# EAGLE design esp_tiny1 (EAGLE 7.6.0)
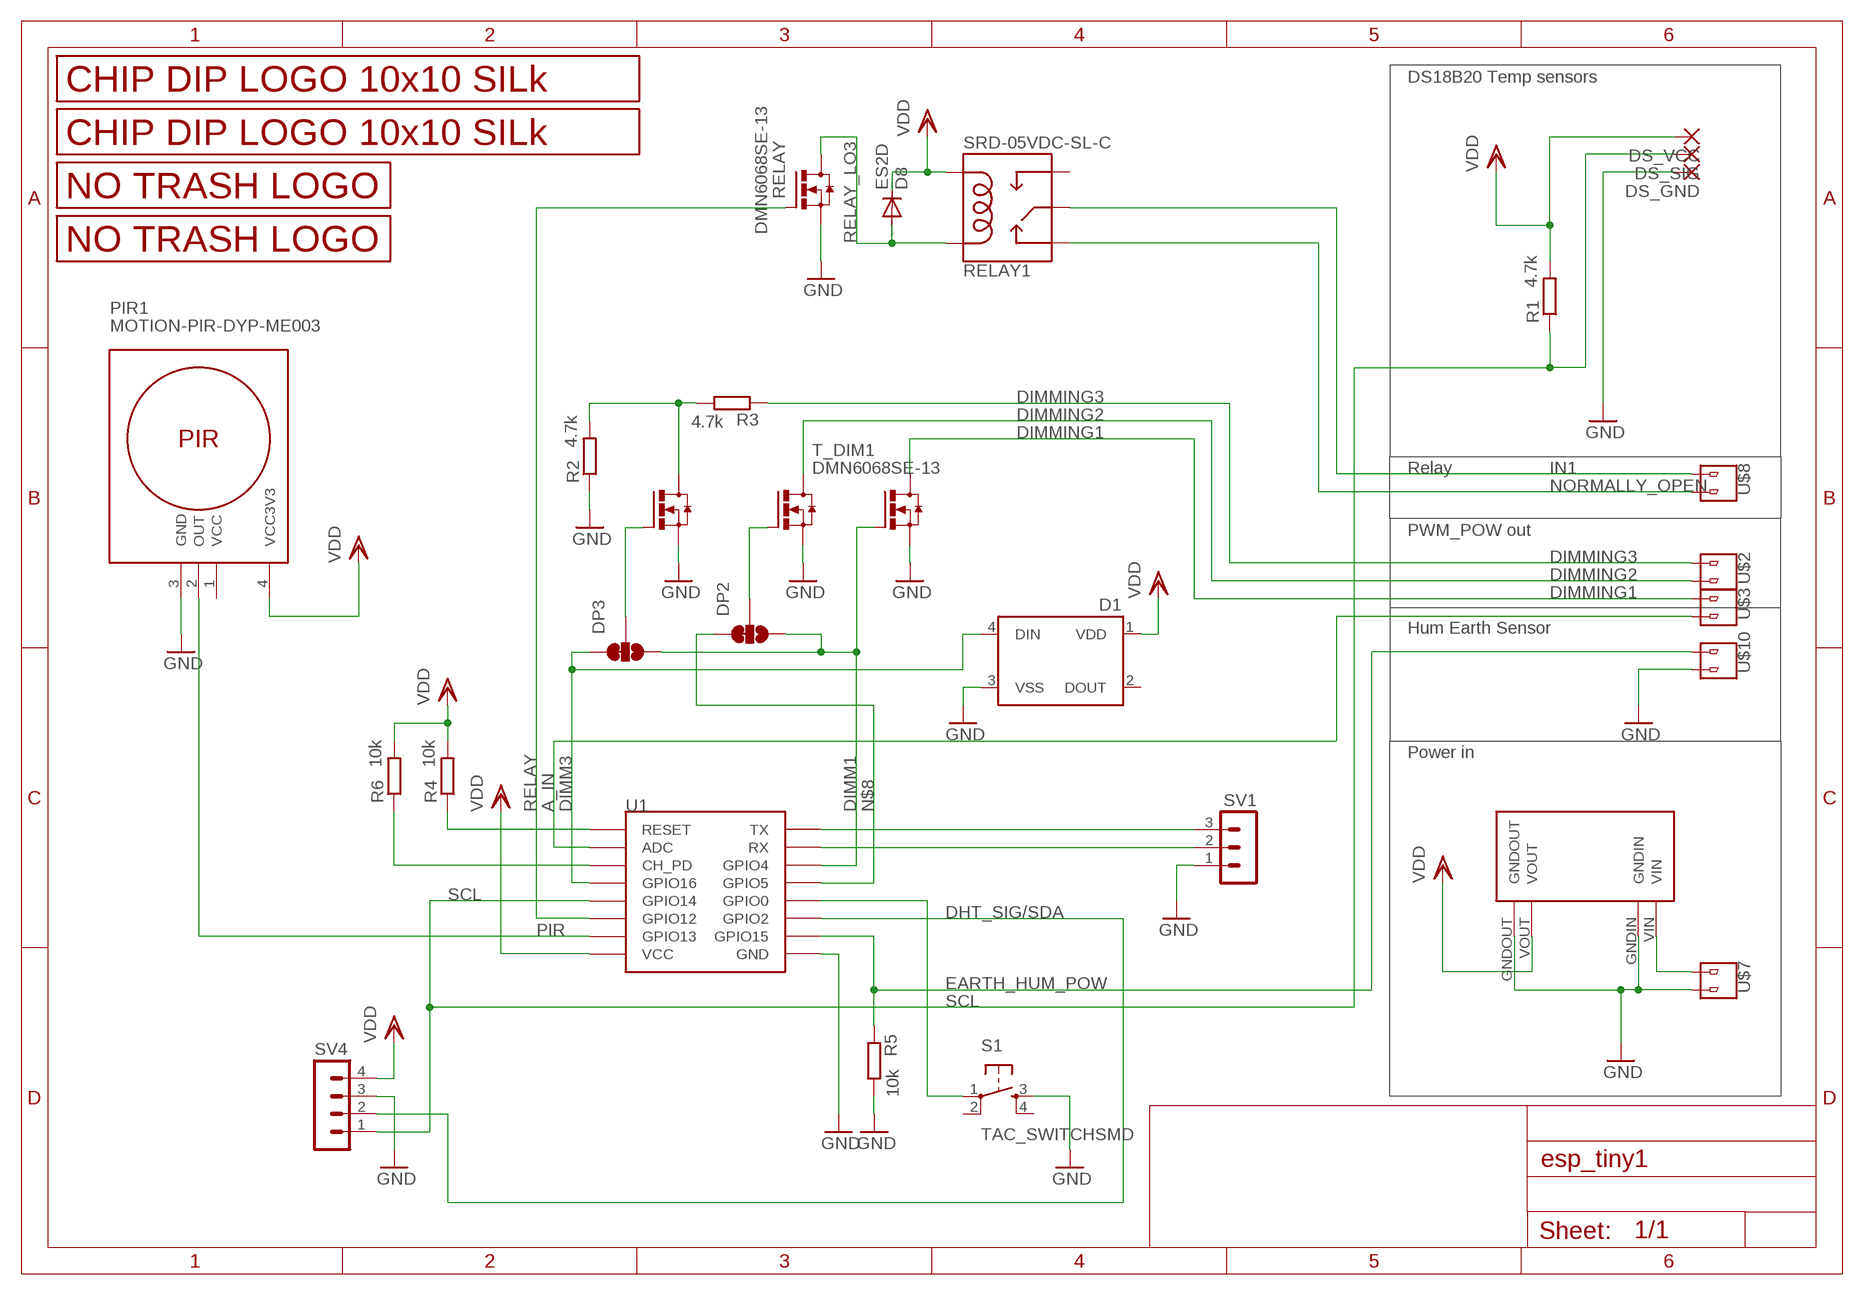
[diagram p0: schematic, sheet 1]

## Parts
D1  WS2812B  [WS2812B]
D8  ES2D  DIODE-SMB  [SMB]
DP2  SMD_SJ_3WAY_CLOSED  [SMD_SJ_3WAY_CLOSED]
DP3  SMD_SJ_3WAY_CLOSED  [SMD_SJ_3WAY_CLOSED]
DS_GND  SMD2  [SMD1,27-2,54]
DS_SIG  SMD2  [SMD1,27-2,54]
DS_VCC  SMD2  [SMD1,27-2,54]
PIR1  MOTION-PIR-DYP-ME003  [MOTION-PIR-DYP-ME003_FRAMELESS]
R1  4.7k  R-EU_M0805  [M0805]
R2  4.7k  R-EU_M0805  [M0805]
R3  4.7k  R-EU_M0805  [M0805]
R4  10k  R-EU_M0805  [M0805]
R5  10k  R-EU_M0805  [M0805]
R6  10k  R-EU_M0805  [M0805]
RELAY  DMN6068SE-13  NMOSFET_SMD_223  [SOT223]
RELAY1  SRD-05VDC-SL-C  RELAYPTH  [SRD-05VDC-SL-C]
S1  TAC_SWITCHSMD  [TACTILE-SWITCH-SMD]
SV1  MA03-1  [MA03-1]
SV4  MA04-1  [MA04-1]
T_DIM1  DMN6068SE-13  NMOSFET_SMD_223  [SOT223]
T_DIM2  DMN6068SE-13  NMOSFET_SMD_223  [SOT223]
T_DIM3  DMN6068SE-13  NMOSFET_SMD_223  [SOT223]
U1  ESP12SMD  [ESP12-SMD]
U$1  LOGO_10X10_SILK  [LOGO2_10X10_SILK]
U$2  V1  2_PIN_CONNECTOR  [2_SCREW_PIN]
U$3  V1  2_PIN_CONNECTOR  [2_SCREW_PIN]
U$4  LOGO_NO_TRASHNO_TRASH  [LOGO_ROHS_NO_TRASH]
U$7  V1  2_PIN_CONNECTOR  [2_SCREW_PIN]
U$8  V1  2_PIN_CONNECTOR  [2_SCREW_PIN]
U$9  LOGO_NO_TRASHROHS  [LOGO_ROHS_SYM]
U$10  V1  2_PIN_CONNECTOR  [2_SCREW_PIN]
U$11  LOGO_10X10_SILK  [LOGO2_10X10_SILK]
U$12  MP1584EN  [MP1584EN]

## Nets
A_IN: U1.ADC U$3.P$2
DHT_SIG/SDA: SV4.2 U1.GPIO2
DIMM1: DP2.3 DP3.3 T_DIM1.1(G) U1.GPIO4
DIMM3: D1.4(DIN) DP3.1 U1.GPIO16
DIMMING1: T_DIM1.2(D) T_DIM1.4(D) U$3.P$1
DIMMING2: T_DIM2.2(D) T_DIM2.4(D) U$2.P$2
DIMMING3: R3.1 U$2.P$1
EARTH_HUM_POW: R5.1 U1.GPIO15 U$10.P$1
GND: D1.3(VSS) DS_GND.1(P) PIR1.3(GND) R2.1 R5.2 RELAY.3(S) S1.3 SV1.1 SV4.3 T_DIM1.3(S) T_DIM2.3(S) T_DIM3.3(S) U1.GND U$7.P$2 U$10.P$2 U$12.GNDIN U$12.GNDOUT
IN1: RELAY1.SWCOMMON U$8.P$1
N$1: R6.1 U1.CH_PD
N$2: R4.1 U1.RESET
N$3: R2.2 R3.2 T_DIM3.2(D) T_DIM3.4(D)
N$4: SV1.3 U1.TXD0(TX)
N$6: SV1.2 U1.RXD0(RX)
N$7: S1.1 U1.GPIO0
N$8: DP2.1 U1.GPIO5
N$17: U$7.P$1 U$12.VIN
N$20: DP3.2 T_DIM3.1(G)
N$21: DP2.2 T_DIM2.1(G)
NORMALLY_OPEN: RELAY1.SWCLOSED(SWCLOSE) U$8.P$2
PIR: PIR1.2(OUT) U1.GPIO13
RELAY: RELAY.1(G) U1.GPIO12
RELAY_LO3: D8.A RELAY1.COIL1 RELAY.2(D) RELAY.4(D)
SCL: DS_SIG.1(P) R1.1 SV4.1 U1.GPIO14
VDD: D1.1(VDD) D8.C DS_VCC.1(P) PIR1.4(VCC3V3) R1.2 R4.2 R6.2 RELAY1.COIL0 SV4.4 U1.VCC U$12.VOUT
Unconnected: D1.2(DOUT) RELAY1.SWOPEN S1.2 S1.4

## Notes on the sheet
- DS18B20 Temp sensors
- Relay
- PWM_POW out
- Hum Earth Sensor
- Power in

## Power pins joined to a net without a drawn wire
VCC: PIR1.1(VCC)

## Library data of the parts
D1 = SparkFun-LED:WS2812B: WS2812B - Intelligent control LED integrated light source Technical Specifications: Power Supply Voltage (VDD): 3.5 to 5.3 V Input Voltage (VI): -0.5 to VDD+0.5 V Operating Junction Temperature (Topt): -25°C to +80°C Storage Temperature Range (Tstg): -55°C to +150°C; PROD_ID: DIO-12503
D8 = diode:DIODE-: DIODE
DP2 DP3 = JKW_CHIP:SMD_SJ_3WAY_CLOSED
DS_GND DS_SIG DS_VCC = wirepad:SMD2: SMD PAD
PIR1 = diy-modules:MOTION-PIR-DYP-ME003: PIR Motion Sensor Module DYP-ME003 based on BISS0001 pyroelectic detector Click here to find device on ebay.com <http://www.ebay.com/sch/dyp+me003>
R1-R6 = rcl:R-EU_: RESISTOR, European symbol
RELAY T_DIM1-T_DIM3 = transistor-power:NMOSFET_SMD_223
RELAY1 = JKW_CHIP:RELAY: SPDT relay (COM-00101)
S1 = SparkFun-Retired:TAC_SWITCH: Momentary Switch Button commonly used for reset or general input. Spark Fun Electronics SKU : COM-00097 SMT- SWCH-08247; PROD_ID: SWCH-08247
SV1 = con-lstb:MA03-1: PIN HEADER; OC_FARNELL: unknown; OC_NEWARK: unknown
SV4 = con-lstb:MA04-1: PIN HEADER; OC_FARNELL: unknown; OC_NEWARK: unknown
U1 = esp8266modules:ESP12: ESP8266 Wifi module 12
U$1 U$11 = JKW_CHIP:LOGO_10X10_SILK
U$2 U$3 U$7 U$8 U$10 = JKW_CHIP:2_PIN_CONNECTOR
U$4 U$9 = JKW_CHIP:LOGO_NO_TRASH
U$12 = JKW_CHIP:MP1584EN

## Board
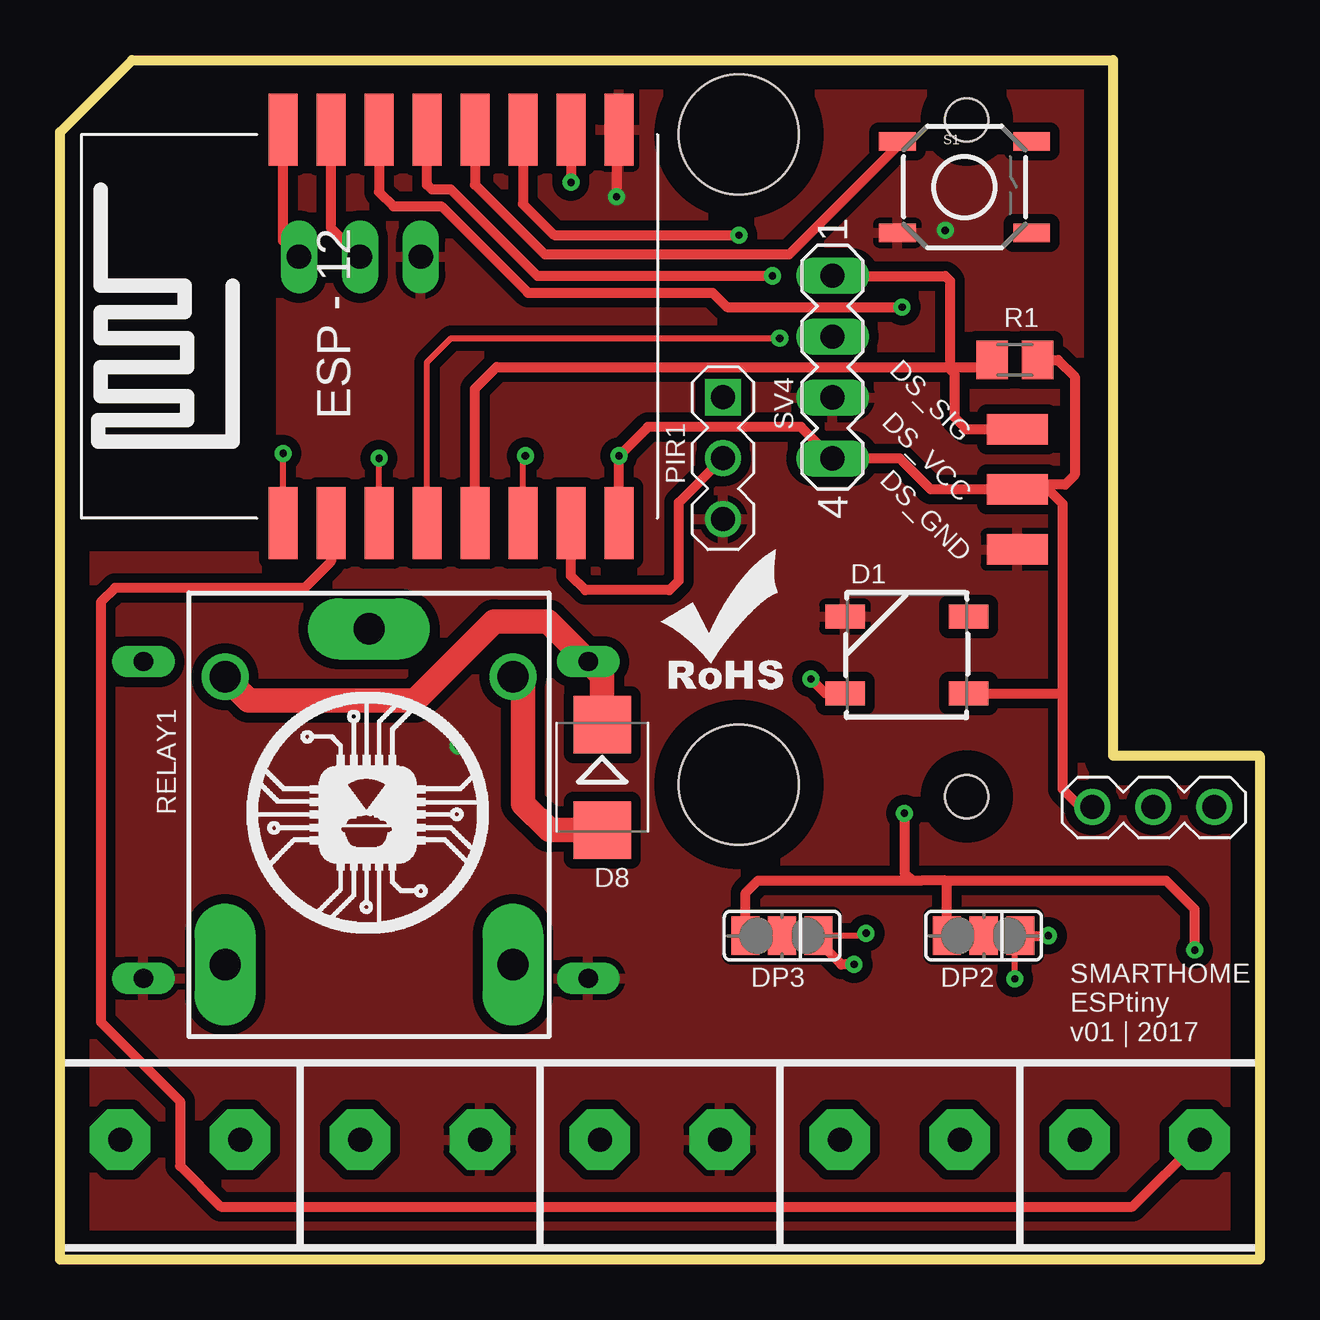
[diagram p1: board, top side]
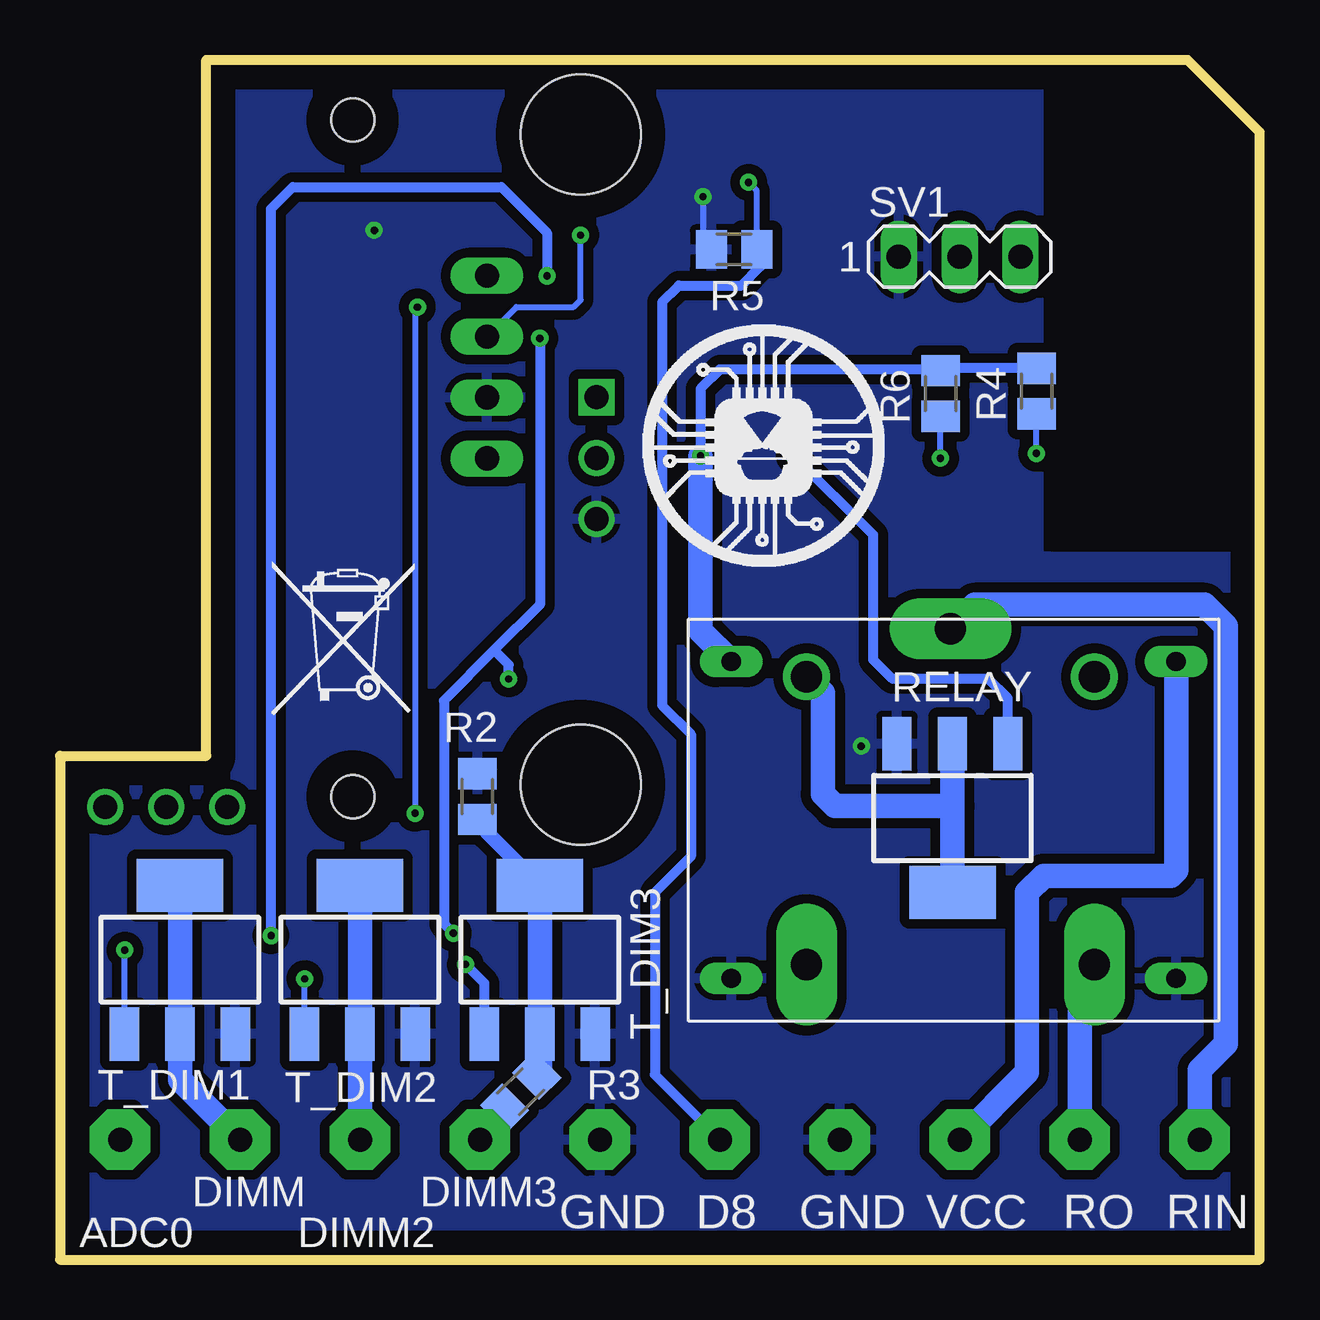
[diagram p2: board, bottom side, seen from below]

Size 50 x 50 mm. Coordinates in mm from the lower left corner, seen from the top.
Outline: 0,0 0,47 3,50 43.9,50 43.9,21 50,21 50,0 0,0
Copper layers (1*16): Top 0.035mm / dielectric 1.5mm / Bottom 0.035mm
Design rules "default": minimum track width 10mil, minimum drill 24mil, track to track 8mil, track to pad 8mil, pad to pad 8mil, via to via 8mil, smd to smd 8mil, copper to edge 40mil, drill to drill 8mil, minimum pad ring 10mil, minimum via ring 8mil, stop-mask expansion 4mil, vias tented up to drill 0mil, thermal gap 10mil
Holes 5 mm at 28.3,19.8 28.3,46.9
tRestrict: area 0.6,30 to 8.5,47.4
bRestrict: area 0.6,29.9 to 8.6,47.3

### Footprints (pad centres in the part's own frame; a part is rotated, then mirrored left to right if it is on the bottom)
WS2812B = smd 1.651 x 1: 1 -2.577,1.6; 2 -2.577,-1.6; 3 2.577,-1.6; 4 2.577,1.6
SMB = smd 2.4 x 2.4: A 2.2,0; C -2.2,0
SMD_SJ_3WAY_CLOSED = smd 1.168 x 1.6: 1 -1.524,0; 2 0,0; 3 1.524,0
SMD1,27-2,54 = smd 1.27 x 2.54: 1 0,0
MOTION-PIR-DYP-ME003_FRAMELESS = drill 1 square: 1 -3.81,-10.16 | drill 1: 2 -1.27,-10.16; 3 1.27,-10.16; 4 13.27,5.23; 5 13.27,7.77; 6 13.27,10.31 | hole 1.8: -15.37,0; 12.83,0
M0805 = smd 1.3 x 1.6: 1 -0.95,0; 2 0.95,0
SOT223 = smd 1.219 x 2.235: 1 -2.311,-3.099; 2 0,-3.099; 3 2.311,-3.099 | smd 3.6 x 2.2: 4 0,3.099
SRD-05VDC-SL-C = drill 1.3: COIL0 -5.39,-6.12; COIL1 -5.39,5.88 | drill 1.3 pad 2.54 long: SWCLOSED 6.61,-6.12; SWCOMMON -7.39,-0.12; SWOPEN 6.61,5.88
TACTILE-SWITCH-SMD = smd 1.524 x 0.762: 1 -2.794,1.905; 2 2.794,1.905; 3 -2.794,-1.905; 4 2.794,-1.905
MA03-1 = drill 1.016 long: 1 -2.54,0; 2 0,0; 3 2.54,0
MA04-1 = drill 1.016 long: 1 -3.81,0; 2 -1.27,0; 3 1.27,0; 4 3.81,0
ESP12-SMD = smd 3 x 1.2: ADC -8.3,3.8; CH_PD -8.3,1.8; GND 8.1,-8.2; GPIO0 8.1,-2.2; GPIO2 8.1,-4.2; GPIO4 8.1,1.8; GPIO5 8.1,-0.2; GPIO12 -8.3,-4.2; GPIO13 -8.3,-6.2; GPIO14 -8.3,-2.2; GPIO15 8.1,-6.2; GPIO16 -8.3,-0.2; RESET -8.3,5.8; RXD0 8.1,3.8; TXD0 8.1,5.8; VCC -8.3,-8.2
2_SCREW_PIN = drill 1 pad 2.54 octagon: P$1 -2.5,0.5; P$2 2.5,0.5
MP1584EN = drill 0.8 long: GNDIN 1.778,14.986; GNDOUT 20.32,14.986; VIN 1.778,1.778; VOUT 20.32,1.778

### Placement (x,y rotation side)
D1  35.3,25.2 180 top
D8  22.6,20.1 270 top
DP2  38.5,13.5 180 top
DP3  30.1,13.5 180 top
DS_GND  39.9,29.6 90 top
DS_SIG  39.9,34.6 90 top
DS_VCC  39.9,32.1 90 top
PIR1  37.8,32.13 270 top
R1  39.8,37.5 0 top
R2  32.6,19.3 270 bottom
R3  30.8,7 45 bottom
R4  9.3,36.2 90 bottom
R5  21.9,42.1 180 bottom
R6  13.3,36.1 90 bottom
RELAY  12.8,18.4 180 bottom
RELAY1  13,18.9 270 top
S1  37.7,44.7 0 top
SV1  12.5,41.8 0 bottom
SV4  32.2,37.2 270 top
T_DIM1  45,12.5 0 bottom
T_DIM2  37.5,12.5 0 bottom
T_DIM3  30,12.5 0 bottom
U1  15.1,39 90 top
U$1  25.7,28.9 0 bottom
U$2  35,4.5 0 top
U$3  45,4.5 0 top
U$4  41.2,22.7 0 bottom
U$7  15,4.5 0 top
U$8  5,4.5 0 top
U$9  24.6,23.7 0 top
U$10  25,4.5 0 top
U$11  7.8,13.6 0 top
U$12  1.7,26.7 180 bottom

### Tracks (layer width: path | path; a pad name or v marks a point on that pad's centre or on a via)
A_IN
  Top 0.406: U1.ADC 11.3,29.1 10.2,28 2.3,28 1.7,27.4 1.7,9.9 5,6.6 5,3.9 6.7,2.2 44.7,2.2 U$3.P$2
DHT_SIG/SDA  (via drill 0.3)
  Top 0.406: U1.GPIO2 19.3,44 20.6,42.7 v28.3,42.7
  Bottom 0.254: SV4.2 30.97,39.7 28.6,39.7 28.3,40 v28.3,42.7
DIMM1  (via drill 0.3)
  Top 0.254: 36.98,15.72 36.9,15.8
  Top 0.406: DP3.3 28.58,15.28 29.1,15.8 35.5,15.8 | 35.5,15.8 35.9,15.8 36.9,15.8 46.1,15.8 47.3,14.6 v47.3,12.9 | v35.2,18.6 35.2,16.1 35.5,15.8 | DP2.3 36.98,15.72 | U1.GPIO4 13.3,44.5 13.9,43.9 15.9,43.9 19.5,40.3 27.2,40.3 27.8,39.7 v35.1,39.7
  Bottom 0.254: T_DIM1.1 47.31,12.89 v47.3,12.9 | v35.1,39.7 35.2,39.6 v35.2,18.6
DIMM3  (via drill 0.3)
  Top 0.254: U1.GPIO16 15.3,37.4 16.3,38.4 v30,38.4 | v33.6,13.6 33.5,13.5 DP3.1
  Top 0.406: D1.4 31.9,23.6 v31.3,24.2
  Bottom 0.406: v30,38.4 30,27.3 31.9,25.4 | 31.9,25.4 34,23.3 34,14 v33.6,13.6 | v31.3,24.2 31.3,24.8 31.9,25.4
DIMMING1
  Bottom 1.016: T_DIM1.4 T_DIM1.2 45,7.5 U$3.P$1
DIMMING2
  Bottom 1.016: U$2.P$2 37.5,8.9 T_DIM2.2 T_DIM2.4
DIMMING3
  Bottom 1.016: R3.1 32.5,5.3 U$2.P$1
EARTH_HUM_POW  (via drill 0.3)
  Top 0.406: U1.GPIO15 v21.3,44.9
  Bottom 0.254: R5.1 20.95,44.55 v21.3,44.9
  Bottom 0.406: U$10.P$1 25.2,7.7 25.2,15.3 23.7,16.8 23.7,21.9 24.9,23.1 24.9,39.9 24.2,40.6 21.6,40.6 20.8,41.4 20.8,41.95 R5.1
GND  (via drill 0.3)
  Top 0.254: 23.3,44.4 v23.2,44.3
  Top 0.406: U1.GND 23.2,47 v23.2,44.3
  Bottom 0.254: v23.2,44.3 23.2,42.45 R5.2
  other vias: 16.6,21.4 36.9,42.9
  pour Top (isolate 0.406, rank 6): 49.9,20.9 43.8,20.9 43.8,49.9 8.8,49.8 9.2,49.8 9.2,29.3 0.2,29.3 0.2,0.2 49.9,0.1
  pour Bottom (isolate 0.406): 9.2,49.9 43.8,49.9 43.8,20.9 49.9,20.9 49.9,0.1 0.2,0.2 0.2,29.3 9.2,29.3
IN1
  Bottom 1.016: U$8.P$1 2.5,7.9 1.4,9 1.4,26.4 2.3,27.3 11.87,27.3 RELAY1.SWCOMMON
N$1  (via drill 0.3)
  Top 0.254: U1.CH_PD v13.3,33.4
  Bottom 0.254: v13.3,33.4 R6.1
N$2  (via drill 0.3)
  Top 0.254: U1.RESET v9.3,33.6
  Bottom 0.254: v9.3,33.6 R4.1
N$3
  Bottom 0.61: R2.2 32.2,17.8 T_DIM3.4
  Bottom 1.016: R3.2 30,7.8 T_DIM3.2 T_DIM3.4
N$4
  Top 0.406: SV1.3 9.3,42.46 U1.TXD0
N$6
  Top 0.406: SV1.2 11.3,43 U1.RXD0
N$7
  Top 0.406: U1.GPIO0 17.3,44.8 20.2,41.9 30.4,41.9 34.91,46.41 S1.1
N$8  (via drill 0.3)
  Top 0.406: DP2.1 v41.2,13.5 | v29.7,41 19.9,41 16.3,44.6 15.5,44.6 15.3,44.8 U1.GPIO5
  Bottom 0.406: v41.2,13.5 41.2,43.8 40.3,44.7 31.6,44.7 29.7,42.8 v29.7,41
N$17
  Bottom 1.016: U$12.VIN 3.48,16.22 3.7,16 9,16 9.7,15.3 9.7,7.8 U$7.P$1
N$20  (via drill 0.3)
  Top 0.406: v33.1,12.3 32.57,12.3 31.37,13.5
  Bottom 0.406: T_DIM3.1 32.31,11.51 v33.1,12.3
N$21  (via drill 0.3)
  Top 0.254: v39.8,11.7 39.8,13.67 39.77,13.5
  Bottom 0.254: T_DIM2.1 39.81,11.49 v39.8,11.7
NORMALLY_OPEN
  Bottom 1.016: U$8.P$2 7.5,11.67 RELAY1.SWCLOSED
PIR
  Top 0.406: PIR1.2 25.8,31.56 25.8,28.3 25.4,27.9 21.9,27.9 21.3,28.5 U1.GPIO13
RELAY  (via drill 0.3)
  Top 0.254: U1.GPIO12 19.3,33.4 v19.4,33.5
  Bottom 0.254: RELAY.1
  Bottom 0.406: RELAY.1 10.5,23.4 11.3,24.2 15.3,24.2 16.1,25 16.1,30.2 v19.4,33.5
RELAY_LO3
  Top 1.016: D8.A 20.4,17.9 19.3,19 19.3,23.87 RELAY1.COIL1
  Bottom 1.016: RELAY.4 12.8,18.9 | 12.8,18.9 RELAY.2 | RELAY1.COIL1 18.2,23.61 18.2,19.4 17.7,18.9 12.8,18.9
SCL
  Top 0.406: 37,37.2 18.2,37.2 17.3,36.3 U1.GPIO14 | 37,37.2 38.55,37.2 R1.1 | DS_SIG.1 37.8,34.6 37.3,35.1 37.3,36.9 37,37.2 | SV4.1 36.9,41 37.1,40.8 37.1,37.3 37,37.2
VDD  (via drill 0.3)
  Top 0.254: SV4.4
  Top 0.406: PIR1.4 42.54,18.86 41.8,19.6 41.8,23.7 | 41.8,23.7 41.8,31.5 41.2,32.1 41.4,32.3 | U1.VCC v23.3,33.5 24.5,34.7 30.89,34.7 SV4.4 35.01,33.39 36.3,32.1 DS_VCC.1 40.1,32.3 41.4,32.3 | R1.2 41.6,37.5 42.3,36.8 42.3,32.7 41.9,32.3 41.4,32.3 | D1.1 41.7,23.6 41.8,23.7
  Top 1.016: RELAY1.COIL0 7.87,23.3 14.8,23.3 18.1,26.6 20.34,26.6 U$12.VOUT | 22,24.9 U$12.VOUT | D8.C 22.6,24.34 U$12.VOUT
  Bottom 0.254: 13.35,37.1 R6.2
  Bottom 0.406: R4.2 13.2,37.15 R6.2 | 13.35,37.1 22.5,37.1 23.3,36.3 v23.3,33.5
  Bottom 1.016: U$12.VOUT 23.3,26.2 v23.3,33.5

### Text on the board
tNames: SMARTHOME / ESPtiny / v01 | 2017
bNames: DIMM3 | DIMM | RIN | RO | VCC | GND | D8 | GND | DIMM2 | ADC0